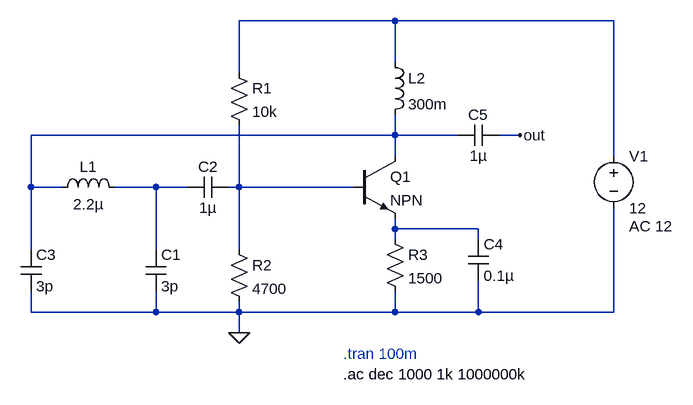
[diagram p0: schematic colipsa_tranzystor.asc]
colipsa_tranzystor.asc, the LTspice schematic file:
Version 4.1
SHEET 1 880 680
WIRE 272 -80 32 -80
WIRE 608 -80 272 -80
WIRE 272 -16 272 -80
WIRE 32 0 32 -80
WIRE 272 96 272 64
WIRE 272 96 -288 96
WIRE 368 96 272 96
WIRE 464 96 432 96
WIRE 272 128 272 96
WIRE 608 128 608 -80
WIRE -288 176 -288 96
WIRE -240 176 -288 176
WIRE -96 176 -160 176
WIRE -48 176 -96 176
WIRE 32 176 32 80
WIRE 32 176 16 176
WIRE 208 176 32 176
WIRE 272 240 272 224
WIRE 400 240 272 240
WIRE 272 256 272 240
WIRE 400 256 400 240
WIRE -288 272 -288 176
WIRE -96 272 -96 176
WIRE 32 272 32 176
WIRE -288 368 -288 336
WIRE -96 368 -96 336
WIRE -96 368 -288 368
WIRE 32 368 32 352
WIRE 32 368 -96 368
WIRE 272 368 272 336
WIRE 272 368 32 368
WIRE 400 368 400 320
WIRE 400 368 272 368
WIRE 608 368 608 208
WIRE 608 368 400 368
WIRE 32 400 32 368
FLAG 32 400 0
FLAG 464 96 out
SYMBOL npn 208 128 R0
SYMATTR InstName Q1
SYMBOL res 16 -16 R0
SYMATTR InstName R1
SYMATTR Value 10k
SYMBOL res 16 256 R0
SYMATTR InstName R2
SYMATTR Value 4700
SYMBOL cap -112 272 R0
SYMATTR InstName C1
SYMATTR Value 3p
SYMBOL cap 16 160 R90
WINDOW 0 0 32 VBottom 2
WINDOW 3 32 32 VTop 2
SYMATTR InstName C2
SYMATTR Value 1µ
SYMBOL cap -304 272 R0
SYMATTR InstName C3
SYMATTR Value 3p
SYMBOL cap 384 256 R0
SYMATTR InstName C4
SYMATTR Value 0.1µ
SYMBOL ind -256 192 R270
WINDOW 0 32 56 VTop 2
WINDOW 3 5 56 VBottom 2
SYMATTR InstName L1
SYMATTR Value 2.2µ
SYMBOL res 256 240 R0
SYMATTR InstName R3
SYMATTR Value 1500
SYMBOL ind 256 -32 R0
SYMATTR InstName L2
SYMATTR Value 300m
SYMBOL cap 432 80 R90
WINDOW 0 0 32 VBottom 2
WINDOW 3 32 32 VTop 2
SYMATTR InstName C5
SYMATTR Value 1µ
SYMBOL voltage 608 112 R0
WINDOW 123 24 124 Left 2
WINDOW 39 0 0 Left 0
SYMATTR InstName V1
SYMATTR Value 12
SYMATTR Value2 AC 12
TEXT 192 432 Left 2 ;.tran 100m
TEXT 192 464 Left 2 !.ac dec 1000 1k 1000000k

The netlist it stands for:
* colipsa_tranzystor.asc
Q1 N002 N004 N005 0 NPN
R1 N001 N004 10k
R2 N004 0 4700
C1 N003 0 3p
C2 N004 N003 1µ
C3 N002 0 3p
C4 N005 0 0.1µ
L1 N002 N003 2.2µ
R3 N005 0 1500
L2 N001 N002 300m
C5 out N002 1µ
V1 N001 0 12 AC 12
.model NPN NPN
.model PNP PNP
.lib standard.bjt
* .tran 100m
.ac dec 1000 1k 1000000k
.backanno
.end